# EasyEDA schematic SCH_Schaltung_alt.json
TITLE: Sheet_1; REV: 1.0; Date: 2024-01-20; Sheet: 1/1; Drawn By: Elhamdouni_Al Nussairi_Bäumler; Company: HTWK Leipzig
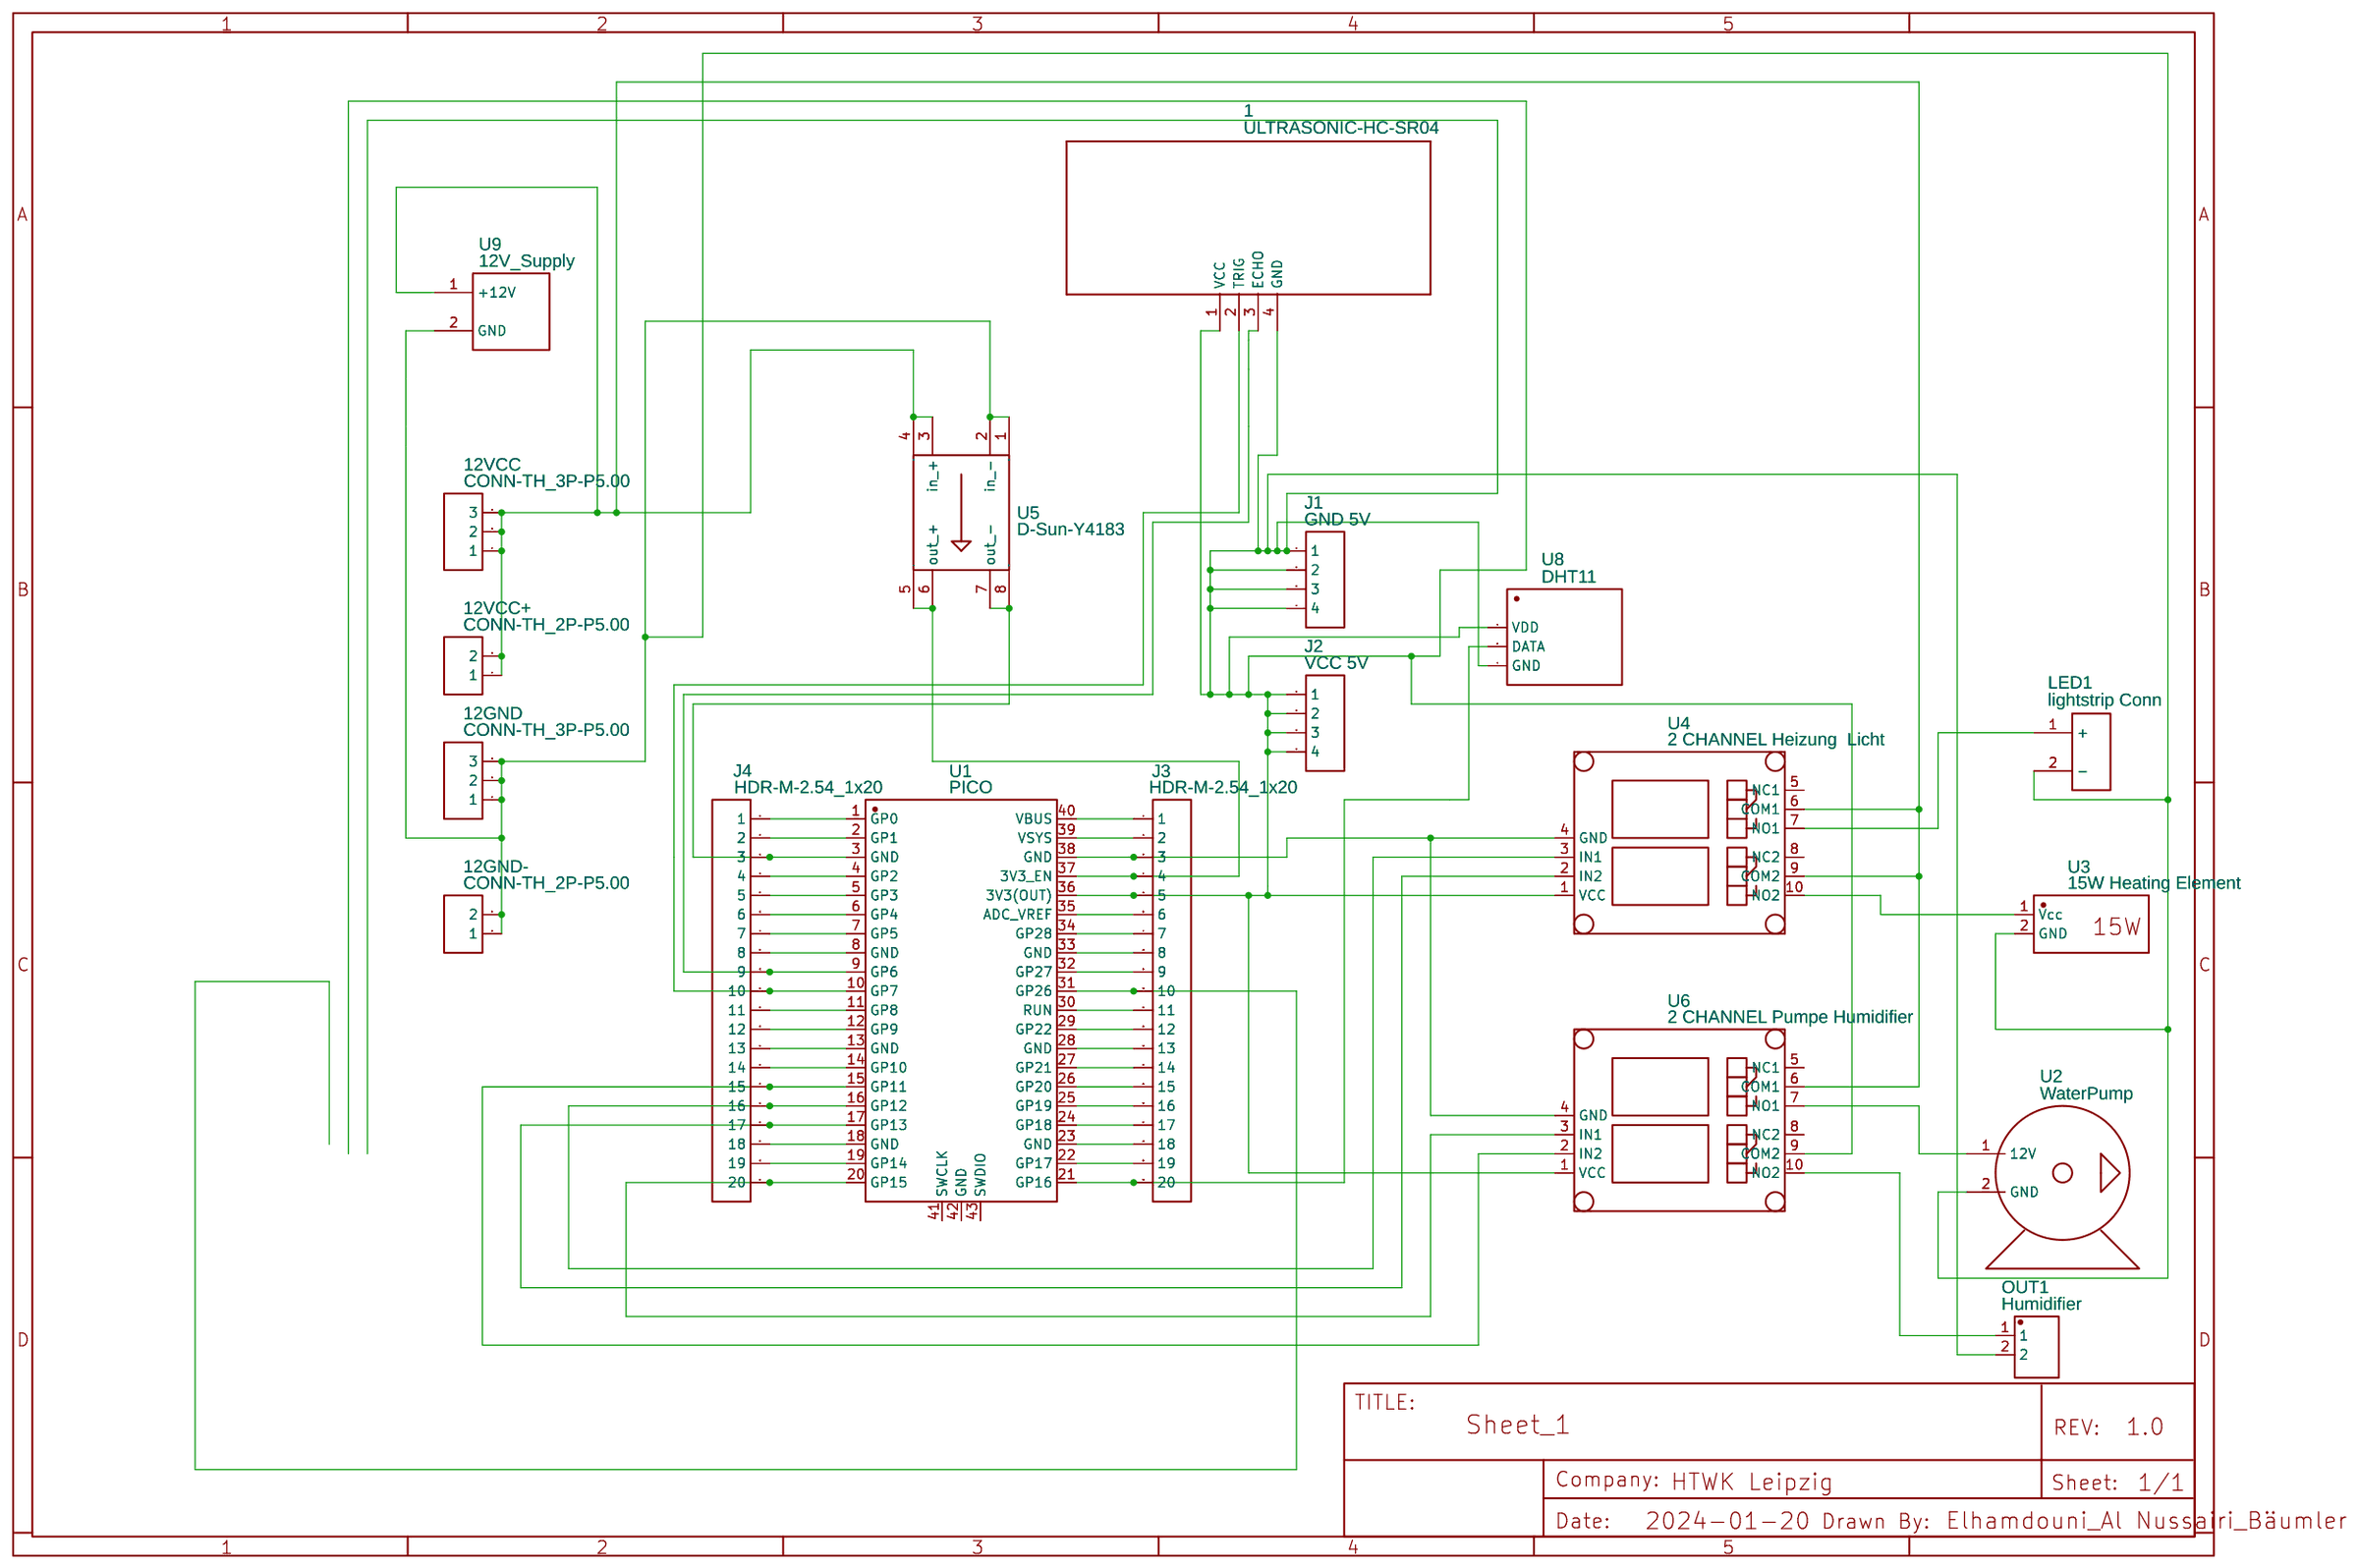
[diagram p0: schematic sheet]

## Parts
1  ULTRASONIC-HC-SR04  [ULTRASONIC-HC-SR04#V]
12GND  CONN-TH_3P-P5.00  [CONN-TH_3P-P5.00]
12GND-  CONN-TH_2P-P5.00  [CONN-TH_2P-P5.00]
12VCC  CONN-TH_3P-P5.00  [CONN-TH_3P-P5.00]
12VCC+  CONN-TH_2P-P5.00  [CONN-TH_2P-P5.00]
J1  GND 5V  [HDR-M-2.54_1X4]
J2  VCC 5V  [HDR-M-2.54_1X4]
J3  HDR-M-2.54_1x20  [HDR-M-2.54_1X20]
J4  HDR-M-2.54_1x20  [HDR-M-2.54_1X20]
LED1  lightstrip Conn  [LIGHTSTRIP CONN]
OUT1  Humidifier  [WJ2EDGVC-5.08-2P]
U1  PICO  [COMM-SMD_L51.0-W21.0-P2.54_SC0916]
U2  WaterPump
U3  15W Heating Element
U4  2 CHANNEL Heizung  Licht  [2 CHANNEL RELAY MODULE]
U5  D-Sun-Y4183  [D-SUN-Y4183]
U6  2 CHANNEL Pumpe Humidifier  [2 CHANNEL RELAY MODULE]
U8  DHT11  [DIP-DHT11]
U9  12V_Supply  [12V_SUPPLY]

## Library data of the parts
1 = ULTRASONIC-HC-SR04: Contributor: John Kana Quispe
12GND 12VCC = CONN-TH_3P-P5.00: Supplier: LCSC; Contributor: LCEDA_Lib
12GND- 12VCC+ = CONN-TH_2P-P5.00: Supplier: LCSC; Contributor: LCEDA_Lib
J1 J2 = HDR-M-2.54_1x4: Supplier Part: C124378; Supplier: LCSC; Contributor: LCEDA_Lib
J3 J4 = HDR-M-2.54_1x20: Supplier Part: C50981; Supplier: LCSC; Contributor: LCEDA_Lib
LED1 = lightstrip Conn: Contributor: 4ravens
OUT1 = HUMIDIFIER: Supplier: LCSC; Manufacturer: ReliaPro; Supplier Part: undefined; Contributor: Alexej Семенюк
U1 = PICO: Supplier: LCSC; Supplier Part: C7203002; Manufacturer: Raspberry Pi(树莓派); JLCPCB Part Class: Extended Part; Contributor: lcsc; link: https://lcsc.com/eda_search?q=C7203002&%26type=1&ref=editor
U2 = WaterPump: Contributor: hcalli
U3 = 15W Heating Element: Contributor: schalkvdm
U4 U6 = 2 CHANNEL RELAY MODULE: Contributor: ralphbacon
U5 = D-Sun-Y4183: Contributor: jap5200
U8 = DHT11: Supplier Part: C117051; Supplier: LCSC; Manufacturer: AOSONG; Contributor: Kenny Koe
U9 = 12V_Supply: Contributor: kleine_eiche

## Nets
Net-(1-1): 1.1(VCC) 1.4(GND) J1.1 J1.2 J1.3 J1.4 J2.1 J2.2 J2.3 J2.4 J3.5 OUT1.2 U1.36(3V3(OUT)) U4.1(VCC) U6.1(VCC) U6.9(COM2) U8.1(VDD) U8.4(GND)
Net-(1-2): 1.2(TRIG) J4.10 U1.10(GP7)
Net-(1-3): 1.3(ECHO) J4.9 U1.9(GP6)
Net-(12GND-1): 12GND.1 12GND.2 12GND.3 12GND-.1 12GND-.2 LED1.2(-) U2.2(GND) U3.2(GND) U5.1 U5.2(in -) U9.2(GND)
Net-(12VCC-1): 12VCC.1 12VCC.2 12VCC.3 12VCC+.1 12VCC+.2 U4.6(COM1) U4.9(COM2) U5.3(in +) U5.4 U6.6(COM1) U9.1(+12V)
Net-(J3-1): J3.1 U1.40(VBUS)
Net-(J3-2): J3.2 U1.39(VSYS)
Net-(J3-3): J3.3 U1.38(GND) U4.4(GND) U6.4(GND)
Net-(J3-4): J3.4 U1.37(3V3_EN) U5.5 U5.6(out +)
Net-(J3-6): J3.6 U1.35(ADC_VREF)
Net-(J3-7): J3.7 U1.34(GP28)
Net-(J3-8): J3.8 U1.33(GND)
Net-(J3-9): J3.9 U1.32(GP27)
Net-(J3-10): J3.10 U1.31(GP26)
Net-(J3-11): J3.11 U1.30(RUN)
Net-(J3-12): J3.12 U1.29(GP22)
Net-(J3-13): J3.13 U1.28(GND)
Net-(J3-14): J3.14 U1.27(GP21)
Net-(J3-15): J3.15 U1.26(GP20)
Net-(J3-16): J3.16 U1.25(GP19)
Net-(J3-17): J3.17 U1.24(GP18)
Net-(J3-18): J3.18 U1.23(GND)
Net-(J3-19): J3.19 U1.22(GP17)
Net-(J3-20): J3.20 U1.21(GP16) U8.2(DATA)
Net-(J4-1): J4.1 U1.1(GP0)
Net-(J4-2): J4.2 U1.2(GP1)
Net-(J4-3): J4.3 U1.3(GND) U5.7(out -) U5.8
Net-(J4-4): J4.4 U1.4(GP2)
Net-(J4-5): J4.5 U1.5(GP3)
Net-(J4-6): J4.6 U1.6(GP4)
Net-(J4-7): J4.7 U1.7(GP5)
Net-(J4-8): J4.8 U1.8(GND)
Net-(J4-11): J4.11 U1.11(GP8)
Net-(J4-12): J4.12 U1.12(GP9)
Net-(J4-13): J4.13 U1.13(GND)
Net-(J4-14): J4.14 U1.14(GP10)
Net-(J4-15): J4.15 U1.15(GP11) U6.2(IN2)
Net-(J4-16): J4.16 U1.16(GP12) U4.3(IN1)
Net-(J4-17): J4.17 U1.17(GP13) U4.2(IN2)
Net-(J4-18): J4.18 U1.18(GND)
Net-(J4-19): J4.19 U1.19(GP14)
Net-(J4-20): J4.20 U1.20(GP15) U6.3(IN1)
Net-(LED1-1): LED1.1(+) U4.7(NO1)
Net-(OUT1-1): OUT1.1 U6.10(NO2)
Net-(U2-1): U2.1(12V) U6.7(NO1)
Net-(U3-1): U3.1(Vcc) U4.10(NO2)

Not connected (* = marked no-connect by the designer): U1 41(SWCLK) 42(GND) 43(SWDIO); U4 5(NC1) 8(NC2); U6 5(NC1) 8(NC2)
